# EAGLE design OpAmp_CCCV Regulator_2021_09_21_A (EAGLE 9.6.1)

## Sheet 1 of 2
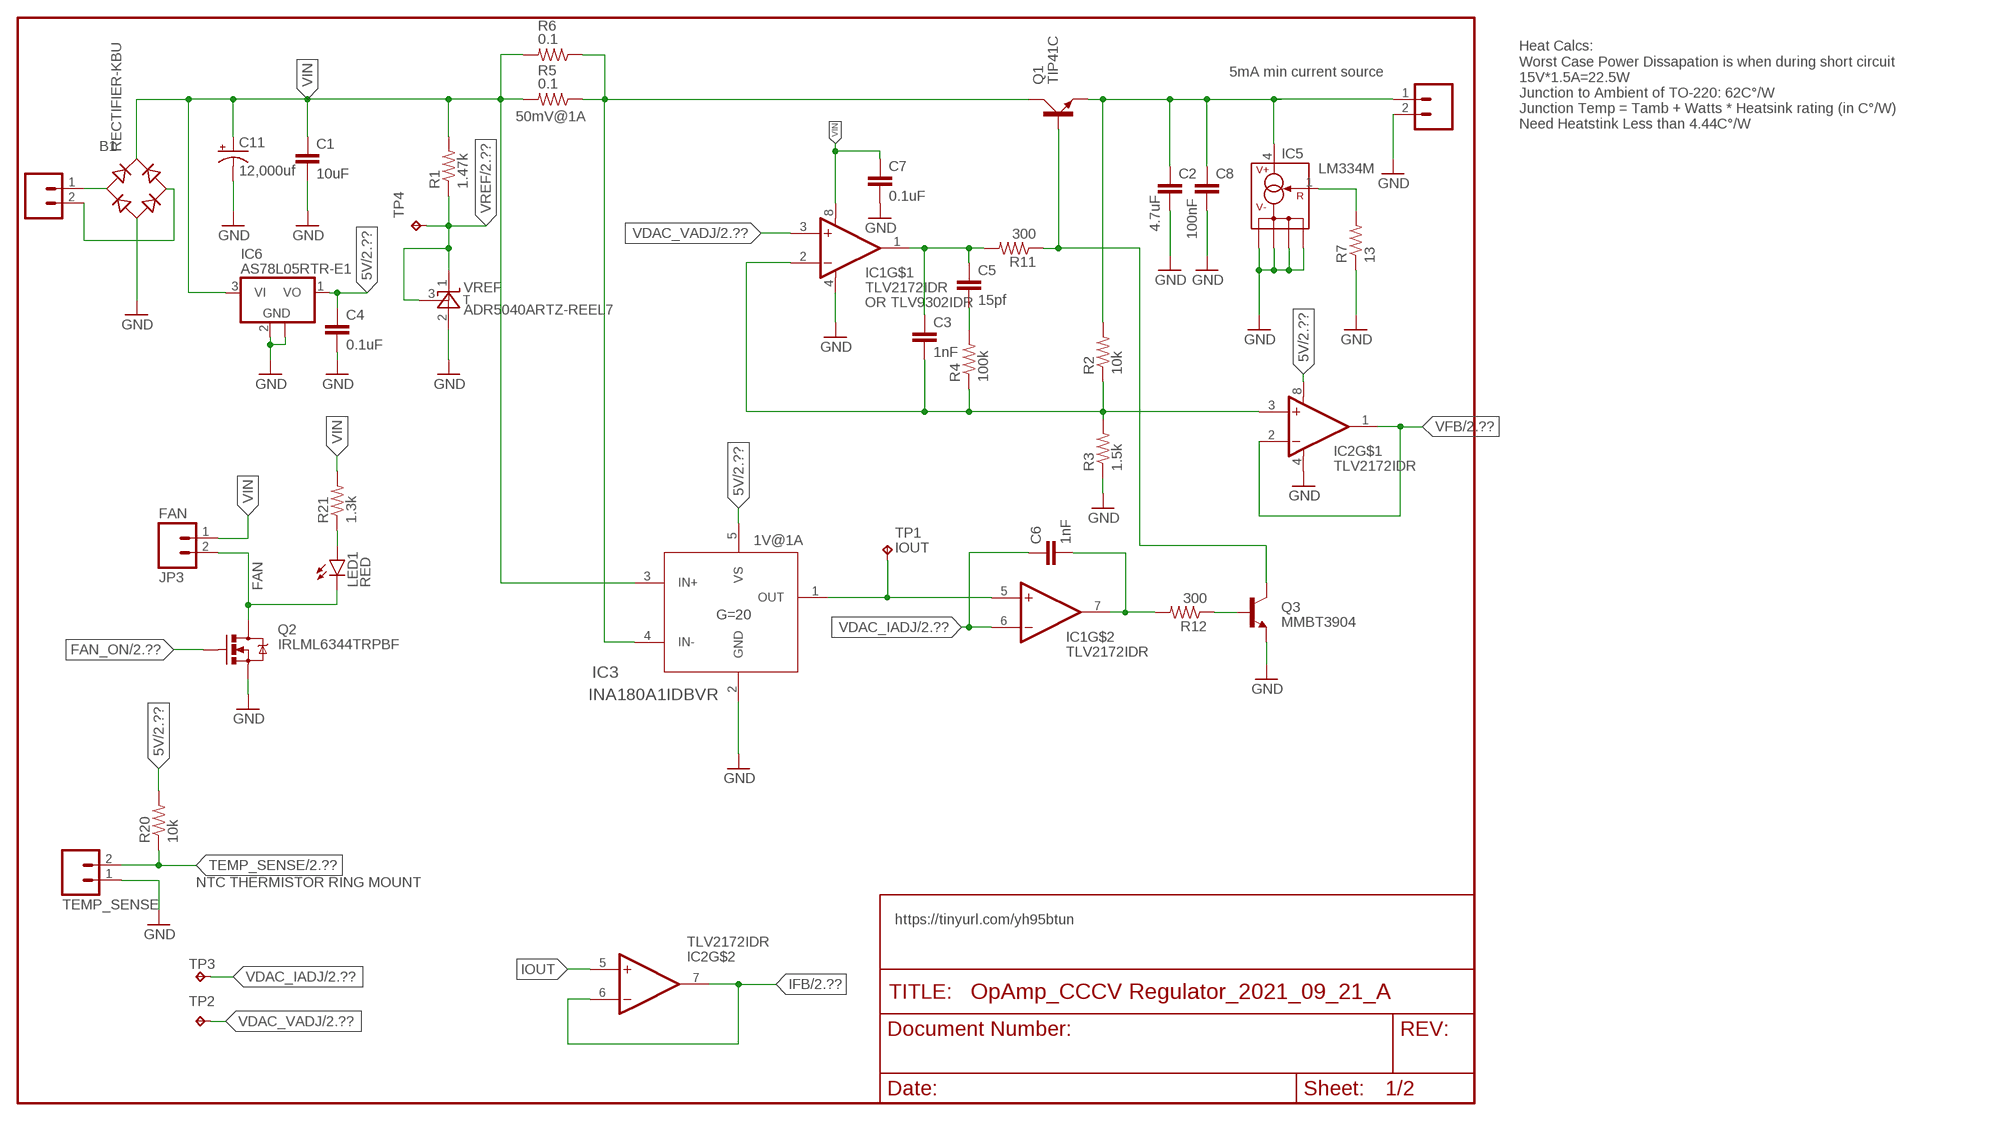
[diagram p0: schematic, sheet 1]

### Parts
B1  RECTIFIER-KBU  [KBU]
C1  10uF  CAP1206  [1206]
C2  4.7uF  CAP1206  [1206]
C3  1nF  CAP0805  [0805]
C4  0.1uF  CAP1206  [1206]
C5  15pf  CAP0805  [0805]
C6  1nF  CAP0805  [0805]
C7  0.1uF  CAP0805  [0805]
C8  100nF  CAP1206  [1206]
C11  12,000uf  CPOL-USE10-25  [EB25D]
IC1  TLV2172IDR  TLV2171IDR  [SOIC8]
IC2  TLV2172IDR  TLV2171IDR  [SOIC8]
IC3  INA180A1IDBVR  [DBV0005A_N]
IC5  LM334M  [SO08]
IC6  AS78L05RTR-E1  78L05F  [SOT89]
JP1  M023.5MM_LOCK  [SCREWTERMINAL-3.5MM-2_LOCK]
JP2  M023.5MM  [SCREWTERMINAL-3.5MM-2]
JP3  FAN  M02POLAR_LOCK  [MOLEX-1X2_LOCK]
JP4  TEMP_SENSE  M02PTH  [1X02]
LED1  RED  LED1206  [LED-1206]
Q1  TIP41C  [TO220AV]
Q2  IRLML6344TRPBF  MOSFET-NCHANNEL2N7002PW  [SOT323]
Q3  MMBT3904  TRANSISTOR_NPNSOT23  [SOT23]
R1  1.47k  RESISTOR1206  [1206]
R2  10k  RESISTOR1206  [1206]
R3  1.5k  RESISTOR1206  [1206]
R4  100k  RESISTOR0805-RES  [0805]
R5  0.1  RESISTOR1206  [1206]
R6  0.1  RESISTOR1206  [1206]
R7  13  RESISTOR1206  [1206]
R11  300  RESISTOR0805-RES  [0805]
R12  300  RESISTOR0805-RES  [0805]
R20  10k  RESISTOR1206  [1206]
R21  1.3k  RESISTOR1206  [1206]
TP1  TPTP20R  [TP20R]
TP2  TPTP20R  [TP20R]
TP3  TPTP20R  [TP20R]
TP4  TPTP20R  [TP20R]
VREF  ADR5040ARTZ-REEL7  [RT_3_ADI]

### Nets
5V: C4.1 IC2.8(V+) IC3.5(VS) IC6.1(VO) R20.2 ; also sheet 2
AC: B1.AC1 JP1.1
COMP: C3.1 C5.1 IC1.1(OUT) R11.2
FAN: JP3.2 LED1.C Q2.3(D)
FAN_ON: Q2.1(G) ; also sheet 2
FB: C3.2 IC1.2(-IN) IC2.3(+IN) R2.1 R3.2 R4.1
GND: B1.- C1.2 C2.2 C4.2 C7.2 C8.2 C11.- IC1.4(V-) IC2.4(V-) IC3.2(GND) IC5.2(V-) IC5.3(V-) IC5.6(V-) IC5.7(V-) IC6.2(GND) IC6.2@1(GND) JP2.2 JP4.1 Q2.2(S) Q3.2(E) R3.1 R7.1 VREF.2(A) ; also sheet 2
IFB: IC2.6(-IN) IC2.7(OUT) ; also sheet 2
IOUT: IC1.5(+IN) IC2.5(+IN) IC3.1(OUT) TP1.TP
IOUTA: C6.2 IC1.7(OUT) R12.2
N$3: C5.2 R4.2
N$5: B1.AC2 JP1.2
N$6: IC5.1(R) R7.2
N$7: Q3.1(B) R12.1
N$14: LED1.A R21.1
PASS_BASE: Q1.B Q3.3(C) R11.1
TEMP_SENSE: JP4.2 R20.1 ; also sheet 2
VDAC_IADJ: C6.1 IC1.6(-IN) TP3.TP ; also sheet 2
VDAC_VADJ: IC1.3(+IN) TP2.TP ; also sheet 2
VFB: IC2.1(OUT) IC2.2(-IN) ; also sheet 2
VIN: B1.+ C1.1 C7.1 C11.+ IC1.8(V+) IC3.3(IN+) IC6.3(VI) JP3.1 R1.2 R5.2 R6.2 R21.2
VIN2: IC3.4(IN-) Q1.C R5.1 R6.1
VOUT: C2.1 C8.1 IC5.4(V+) JP2.1 Q1.E R2.2
VREF: R1.1 TP4.TP VREF.1(C) VREF.3(T) ; also sheet 2

### Notes on the sheet
- 5mA min current source
- 50mV@1A
- Heat Calcs:
  Worst Case Power Dissapation is when during short circuit
  15V*1.5A=22.5W
  Junction to Ambient of TO-220: 62C°/W
  Junction Temp = Tamb + Watts * Heatsink rating (in C°/W)
  Need Heatstink Less than 4.44C°/W
- OR TLV9302IDR
- 1V@1A
- G=20
- NTC THERMISTOR RING MOUNT
- https://tinyurl.com/yh95btun

## Sheet 2 of 2
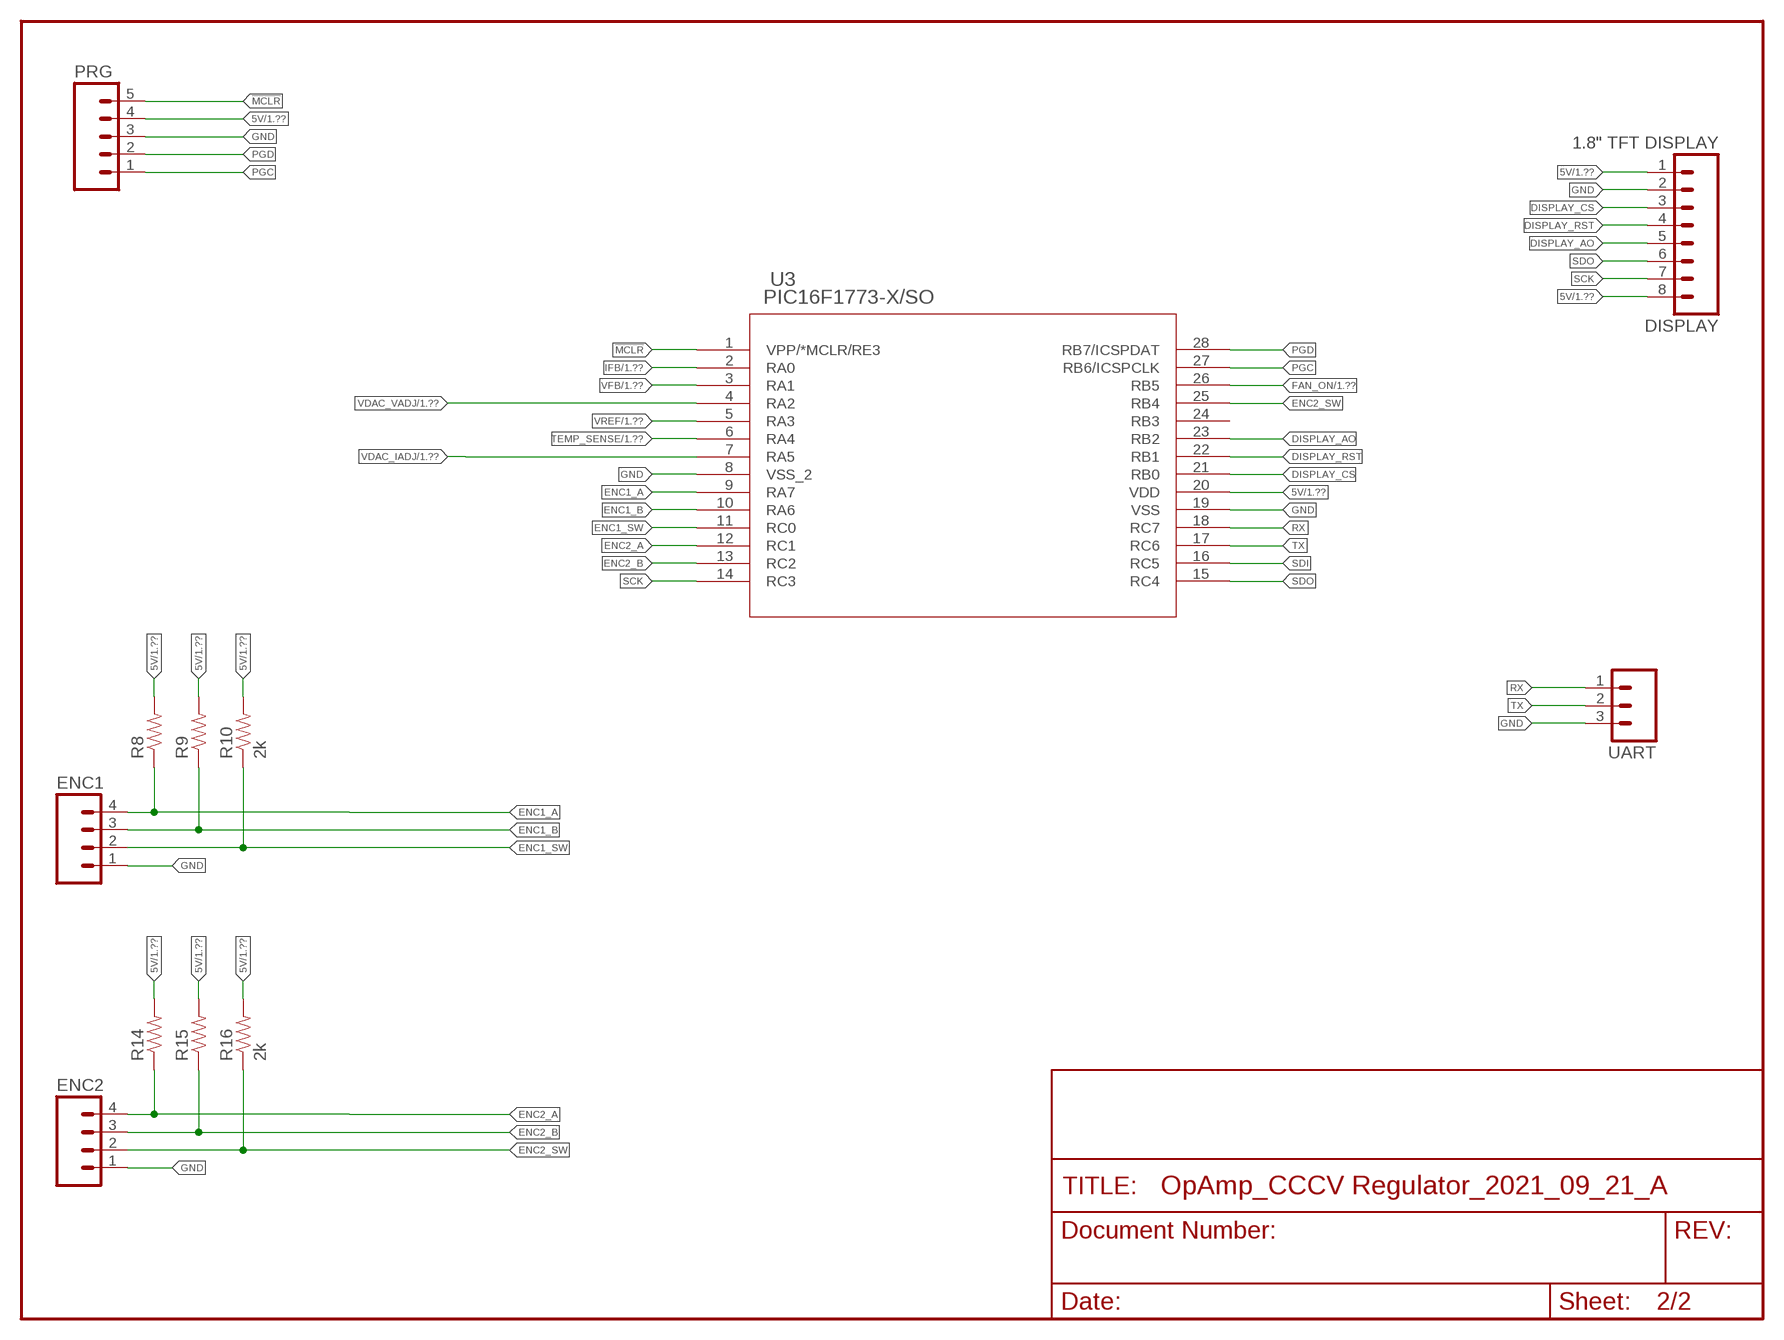
[diagram p1: schematic, sheet 2]

### Parts
DISPLAY  1.8" TFT DISPLAY  M08LOCK_LONGPADS  [1X08_LOCK_LONGPADS]
ENC1  M04LOCK_LONGPADS  [1X04_LOCK_LONGPADS]
ENC2  M04LOCK_LONGPADS  [1X04_LOCK_LONGPADS]
PRG  M05LOCK  [1X05_LOCK]
R8  2k  RESISTOR0805-RES  [0805]
R9  2k  RESISTOR0805-RES  [0805]
R10  2k  RESISTOR0805-RES  [0805]
R14  2k  RESISTOR0805-RES  [0805]
R15  2k  RESISTOR0805-RES  [0805]
R16  2k  RESISTOR0805-RES  [0805]
U3  PIC16F1773-X/SO  [SOIC28-W_MC]
UART  M03LOCK_LONGPADS  [1X03_LOCK_LONGPADS]

### Nets
5V: DISPLAY.1 DISPLAY.8 PRG.4 R8.2 R9.2 R10.2 R14.2 R15.2 R16.2 U3.20(VDD) ; also sheet 1
!MCLR: PRG.5 U3.1(VPP/*MCLR/RE3)
DISPLAY_AO: DISPLAY.5 U3.23(RB2)
DISPLAY_CS: DISPLAY.3 U3.21(RB0)
DISPLAY_RST: DISPLAY.4 U3.22(RB1)
ENC1_A: ENC1.4 R8.1 U3.9(RA7)
ENC1_B: ENC1.3 R9.1 U3.10(RA6)
ENC1_SW: ENC1.2 R10.1 U3.11(RC0)
ENC2_A: ENC2.4 R14.1 U3.12(RC1)
ENC2_B: ENC2.3 R15.1 U3.13(RC2)
ENC2_SW: ENC2.2 R16.1 U3.25(RB4)
FAN_ON: U3.26(RB5) ; also sheet 1
GND: DISPLAY.2 ENC1.1 ENC2.1 PRG.3 U3.8(VSS_2) U3.19(VSS) UART.3 ; also sheet 1
IFB: U3.2(RA0) ; also sheet 1
PGC: PRG.1 U3.27(RB6/ICSPCLK)
PGD: PRG.2 U3.28(RB7/ICSPDAT)
RX: U3.18(RC7) UART.1
SCK: DISPLAY.7 U3.14(RC3)
SDI: U3.16(RC5)
SDO: DISPLAY.6 U3.15(RC4)
TEMP_SENSE: U3.6(RA4) ; also sheet 1
TX: U3.17(RC6) UART.2
VDAC_IADJ: U3.7(RA5) ; also sheet 1
VDAC_VADJ: U3.4(RA2) ; also sheet 1
VFB: U3.3(RA1) ; also sheet 1
VREF: U3.5(RA3) ; also sheet 1
Unconnected: U3.24(RB3)

## Library data of the parts
B1 = rectifier:RECTIFIER-: Rectifier
C1 C2 C4 C8 = SparkFun-Capacitors:CAP: Capacitor Standard 0603 ceramic capacitor, and 0.1" leaded capacitor.
C3 C5-C7 = SparkFun:CAP: Capacitor Standard 0603 ceramic capacitor, and 0.1" leaded capacitor.
C11 = rcl:CPOL-US: POLARIZED CAPACITOR, American symbol; SPICEPREFIX: C
DISPLAY = SparkFun-Connectors:M08: Header 8 Standard 8-pin 0.1" header. Use with straight break away headers (SKU : PRT-00116), right angle break away headers (PRT-00553), swiss pins (PRT-00743), machine pins (PRT-00117), and female headers (PRT-00115).
ENC1 ENC2 = SparkFun-Connectors:M04: Header 4 Standard 4-pin 0.1" header. Use with straight break away headers (SKU : PRT-00116), right angle break away headers (PRT-00553), swiss pins (PRT-00743), machine pins (PRT-00117), and female headers (PRT-00115). Molex polarized connector foot print use with SKU : PRT-08231 with associated crimp pins and housings. 1MM SMD Version SKU: PRT-10208
IC1 IC2 = TLV2171IDR:TLV2171IDR
IC3 = INA180A1IDBVR:INA180A1IDBVR; MANUFACTURER: Texas Instruments; PARTNUMBER: INA180A1IDBVR; REFDES: RefDes; TYPE: TYPE; VALUE: Value
IC5 = linear:LM334*: 3-Terminal Adjustable Current Sources Source: www.national.com/pf/LM/LM334.html | LM134.pdf
IC6 = linear:78L*: POSITOIV-VOLTAGE REGULATORS Output up to 100 mA Source: Datasheet <http://focus.ti.com/lit/ds/symlink/ua78l05.pdf>
JP1-JP4 = SparkFun-Connectors:M02: Standard 2-pin 0.1" header. Use with - straight break away headers ( PRT-00116) - right angle break away headers (PRT-00553) - swiss pins (PRT-00743) - machine pins (PRT-00117) - female headers (PRT-00115) Molex polarized connector foot print use with: PRT-08233 with associated crimp pins and housings. 2.54_SCREWTERM for use with PRT-10571. 3.5mm Screw Terminal footprints for PRT-08084 5mm Screw Terminal footprints for use with PRT-08432
LED1 = SparkFun-LED:LED: LEDs Standard schematic elements and footprints for 5mm, 3mm, 1206, and 0603 sized LEDs. 5mm - Spark Fun Electronics SKU : COM-00529 (and others)
PRG = SparkFun-Connectors:M05: Header 5 Standard 5-pin 0.1" header. Use with straight break away headers (SKU : PRT-00116), right angle break away headers (PRT-00553), swiss pins (PRT-00743), machine pins (PRT-00117), and female headers (PRT-00115). Molex polarized connector foot print use with SKU : PRT-08230 with associated crimp pins and housings.
Q1 = transistor-power:TIP41C: NPN TRANSISTOR
Q2 = SparkFun-DiscreteSemi:MOSFET-NCHANNEL: Common NMOSFET Parts MFG P/N Store ID Prod ID FDD8780 TRANS-09984 SI7820DN TRANS-11055 FDS6630A IC-08089 2N7002PW TRANS-11151 FQP30N06L COM-10213 TRANS-10060 BSS123LT1G TRANS-08345 BSS138 TRANS-00830 BS170 2N7000; PROD_ID: TRANS-11151
Q3 = SparkFun-DiscreteSemi:TRANSISTOR_NPN: Generic NPN BJT MMBT2222A - TRANS-08049 (SOT-23, 1A 40V) MPSA42 - TRANS-09116 (SOT-23, 500mA 300V) MMBT5088LT1G - TRANS-11160 (SOT-23, 50 mA 30V) BC547 - COM-08928 <http://www.sparkfun.com/products/8928> (TO-92 45V 100mA) (1.Collector 2.Base 3.Emitter) 2N3904 - COM-00521 <http://www.sparkfun.com/products/521> (TO-92 40V 200mA) (1.Emitter 2.Base 3.Collector) P2N2222A - COM-12852 <http://www.sparkfun.com/products/12852> (TO-92 40V 600mA) (1.Collector 2.Base 3.Emitter)
R1-R3 R5-R10 R14-R16 R20 R21 = SparkFun-Resistors:RESISTOR: Resistor Basic schematic elements and footprints for 0603, 1206, and PTH resistors.
R4 R11 R12 = SparkFun:RESISTOR: Resistor Basic schematic elements and footprints for 0603, 1206, and PTH resistors.
TP1-TP4 = testpad:TP: Test pad
U3 = PIC16F Series:PIC16F1773-X/SO; COPYRIGHT: Copyright (C) 2016 Accelerated Designs. All rights reserved; MANUFACTURER_PART_NUMBER: pic16f1773-x/so; VENDOR: Microchip
UART = SparkFun-Connectors:M03: Header 3 Standard 3-pin 0.1" header. Use with straight break away headers (SKU : PRT-00116), right angle break away headers (PRT-00553), swiss pins (PRT-00743), machine pins (PRT-00117), and female headers (PRT-00115). Molex polarized connector foot print use with SKU : PRT-08232 with associated crimp pins and housings.
VREF = ADR5040ARTZ:ADR5040ARTZ-REEL7; BUILT_BY: EMA_UL_Team; MANUFACTURER_PART_NUMBER: ADR5040ARTZ-REEL7; SOURCELIBRARY: Analog_2015-01-06; VENDOR: Analog Devices Inc

## Board
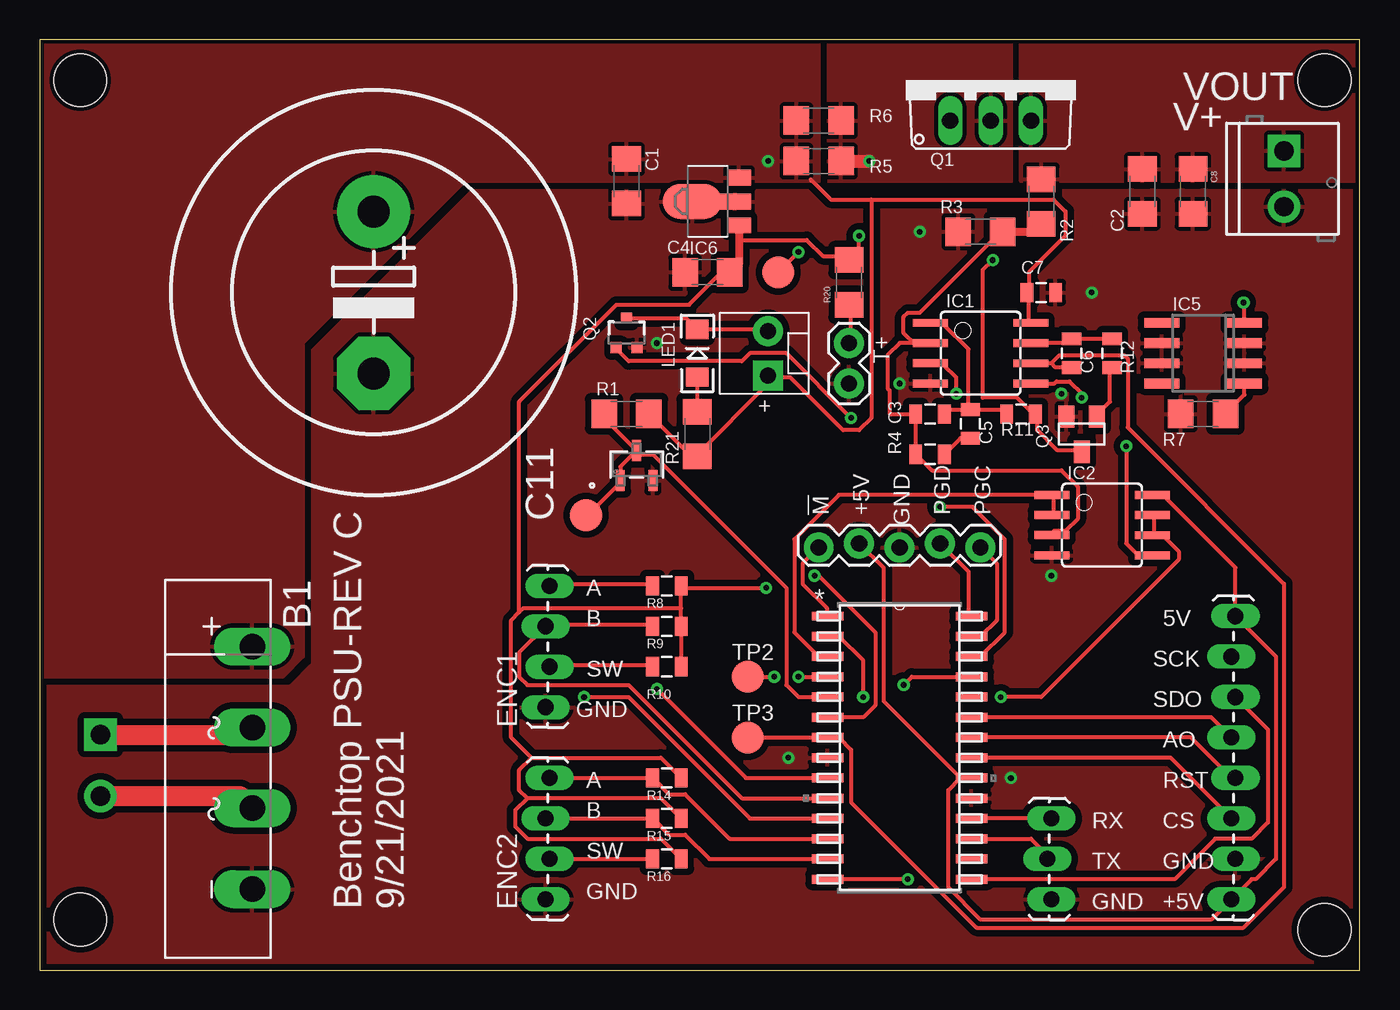
[diagram p2: board, top side]
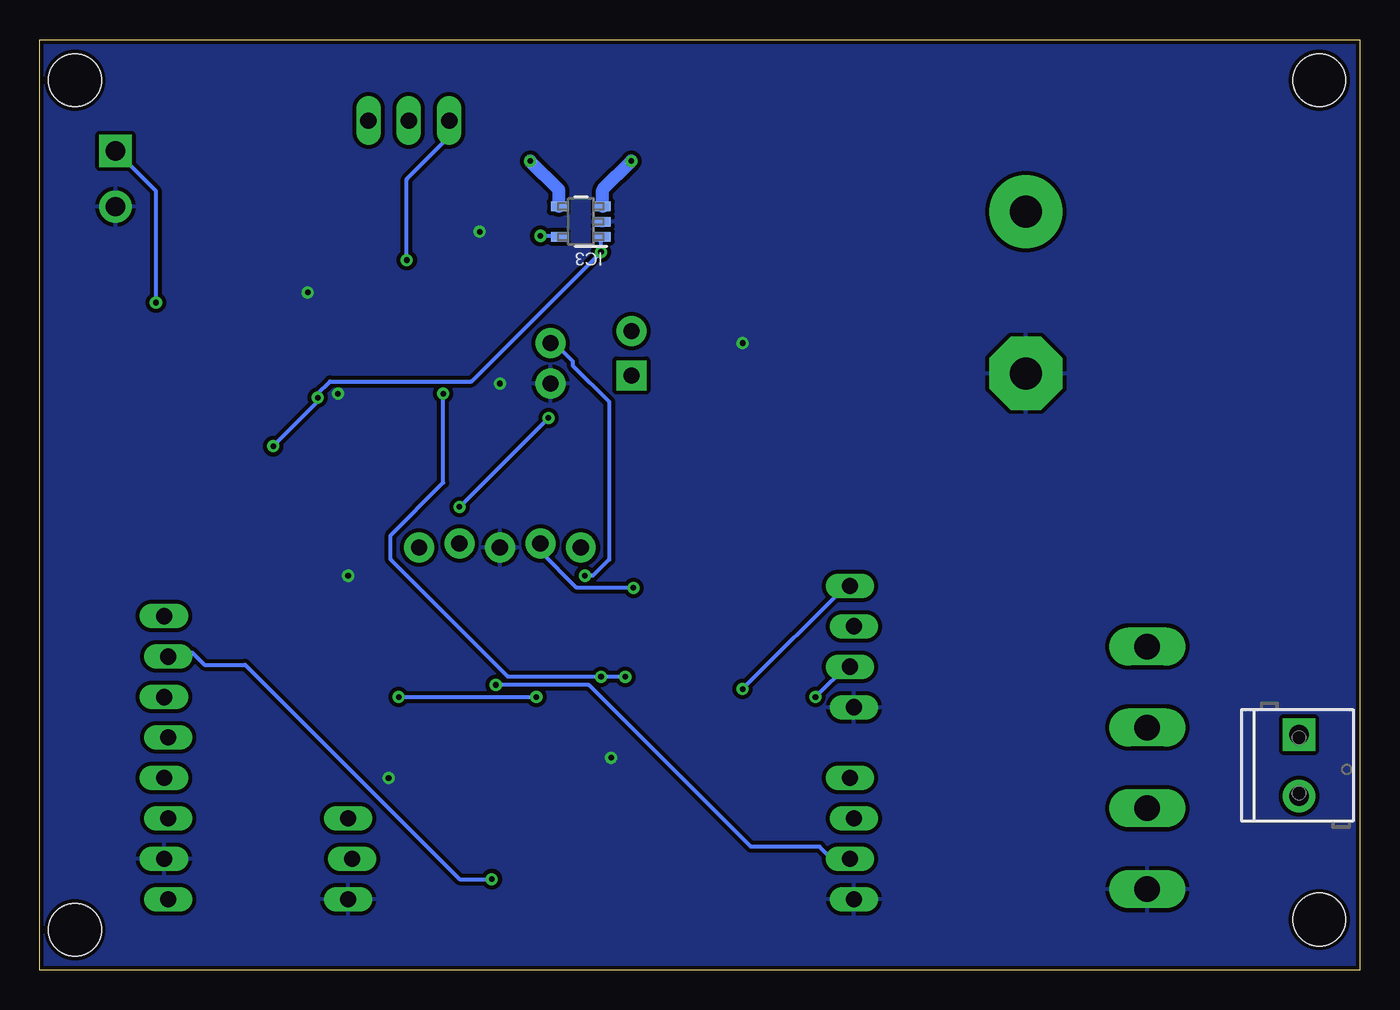
[diagram p3: board, bottom side, seen from below]

Size 82.85 x 58.41 mm. Coordinates in mm from the lower left corner, seen from the top.
Outline: 0,0 82.85,0 82.85,58.41 0,58.41 0,0
Copper layers (1*16): Top 0.035mm / dielectric 1.5mm / Bottom 0.035mm
Design rules "default": minimum track width 10mil, minimum drill 0.35mm, track to track 10mil, track to pad 10mil, pad to pad 10mil, via to via 10mil, smd to smd 6mil, copper to edge 10mil, drill to drill 6mil, minimum pad ring 10mil, minimum via ring 8mil, stop-mask expansion 4mil, vias tented up to drill 0mil, thermal gap 10mil
Holes 3.3 mm at 2.54,55.88 2.54,3.18 80.64,2.54 80.64,55.88

### Footprints (pad centres in the part's own frame; a part is rotated, then mirrored left to right if it is on the bottom)
KBU = drill 1.6 long: + -7.62,2.54; - 7.62,2.54; AC1 -2.54,2.54; AC2 2.54,2.54
1206 = smd 1.6 x 1.8: 1 -1.4,0; 2 1.4,0
0805 = smd 0.8 x 1.2: 1 -0.9,0; 2 0.9,0
EB25D = drill 2.007 pad 4.597: + -5.08,0 | drill 2.007 pad 4.597 octagon: - 5.08,0
1X08_LOCK_LONGPADS = drill 1.016 long: 1 0,0.127; 2 2.54,-0.127; 3 5.08,0.127; 4 7.62,-0.127; 5 10.16,0.127; 6 12.7,-0.127; 7 15.24,0.127; 8 17.78,-0.127
1X04_LOCK_LONGPADS = drill 1.016 long: 1 0,0; 2 2.54,-0.254; 3 5.08,0; 4 7.62,-0.254
SOIC8 = smd 0.5 x 2.2: 1 -1.905,-3.154; 2 -0.645,-3.154; 3 0.625,-3.154; 4 1.895,-3.154; 5 1.905,3.154; 6 0.635,3.154; 7 -0.635,3.154; 8 -1.905,3.154
DBV0005A_N = smd 1 x 0.6: 1 -1.375,0.95; 2 -1.375,0; 3 -1.375,-0.95; 4 1.375,-0.95; 5 1.375,0.95
SO08 = smd 0.6 x 2.2: 1 -1.905,-2.6; 2 -0.635,-2.6; 3 0.635,-2.6; 4 1.905,-2.6; 5 1.905,2.6; 6 0.635,2.6; 7 -0.635,2.6; 8 -1.905,2.6
SOT89 = smd 1 x 1.5: 1 -1.499,-1.981; 3 1.499,-1.981 | smd 1 x 2: 2 0,-1.727 | smd 2.2 x 3.7: 2@1 0,0.94
SCREWTERMINAL-3.5MM-2_LOCK = drill 1.2 pad 2.032 square: 1 -0.178,0 | drill 1.2 pad 2.032: 2 3.678,0
SCREWTERMINAL-3.5MM-2 = drill 1.2 pad 2.032 square: 1 0,0 | drill 1.2 pad 2.032: 2 3.5,0
MOLEX-1X2_LOCK = drill 1.016 pad 1.88 square: 1 -0.127,0 | drill 1.016 pad 1.88: 2 2.667,0
1X02 = drill 1.016 pad 1.88: 1 0,0; 2 2.54,0
LED-1206 = smd 1.2 x 1.4: A -1.5,0; C 1.5,0
1X05_LOCK = drill 1.016 pad 1.88: 1 0,0.127; 2 2.54,-0.127; 3 5.08,0.127; 4 7.62,-0.127; 5 10.16,0.127
TO220AV = drill 1.016 long: B -2.54,-2.54; C 0,-2.54; E 2.54,-2.54
SOT323 = smd 0.7 x 0.7: 1 -0.65,-0.925; 2 0.65,-0.925; 3 0,0.925
SOT23 = smd 1 x 1.4: 1 -0.95,-1.1; 2 0.95,-1.1; 3 0,1.1
TP20R = smd 2 x 2: TP 0,0
SOIC28-W_MC = smd 1.981 x 0.559: 1 -4.521,8.255; 2 -4.521,6.985; 3 -4.521,5.715; 4 -4.521,4.445; 5 -4.521,3.175; 6 -4.521,1.905; 7 -4.521,0.635; 8 -4.521,-0.635; 9 -4.521,-1.905; 10 -4.521,-3.175; 11 -4.521,-4.445; 12 -4.521,-5.715; 13 -4.521,-6.985; 14 -4.521,-8.255; 15 4.521,-8.255; 16 4.521,-6.985; 17 4.521,-5.715; 18 4.521,-4.445; 19 4.521,-3.175; 20 4.521,-1.905; 21 4.521,-0.635; 22 4.521,0.635; 23 4.521,1.905; 24 4.521,3.175; 25 4.521,4.445; 26 4.521,5.715; 27 4.521,6.985; 28 4.521,8.255
1X03_LOCK_LONGPADS = drill 1.016 long: 1 0,0; 2 2.54,-0.254; 3 5.08,0
RT_3_ADI = smd 0.559 x 1.321: 1 -1.025,-1.016; 2 1.025,-1.016; 3 0,0.883

### Placement (x,y rotation side)
B1  10.79,12.7 270 top
C1  36.83,49.53 270 top
C2  69.21,48.9 270 top
C3  55.88,34.92 180 top
C4  41.91,43.81 180 top
C5  58.42,34.29 270 top
C6  64.77,38.73 90 top
C7  62.87,42.55 0 top
C8  72.39,48.9 270 top
C11  20.95,42.55 270 top
DISPLAY  74.93,4.45 90 top
ENC1  31.75,16.51 90 top
ENC2  31.75,4.45 90 top
IC1  59.05,38.73 270 top
IC2  66.67,27.94 270 top
IC3  48.9,46.99 180 bottom
IC5  73.02,38.73 90 top
IC6  41.91,48.26 90 top
JP1  3.81,14.61 270 bottom
JP2  78.1,51.44 270 top
JP3  45.72,37.47 90 top
JP4  50.8,36.83 90 top
LED1  41.27,38.73 90 top
PRG  59.05,26.67 180 top
Q1  59.69,55.88 0 top
Q2  36.83,40.01 0 top
Q3  65.41,33.66 180 top
R1  36.83,34.92 0 top
R2  62.87,48.26 90 top
R3  59.05,46.36 0 top
R4  55.88,32.39 0 top
R5  48.9,50.8 180 top
R6  48.9,53.34 180 top
R7  73.02,34.92 0 top
R8  39.37,24.13 0 top
R9  39.37,21.59 0 top
R10  39.37,19.05 0 top
R11  61.6,34.92 180 top
R12  67.31,38.73 90 top
R14  39.37,12.07 0 top
R15  39.37,9.53 0 top
R16  39.37,6.99 0 top
R20  50.8,43.18 90 top
R21  41.27,33.66 270 top
TP1  46.36,43.81 0 top
TP2  44.45,18.42 0 top
TP3  44.45,14.61 0 top
TP4  34.29,28.57 0 top
U3  53.98,13.97 0 top
UART  63.5,9.53 270 top
VREF  37.47,31.75 0 top

### Tracks (layer width: path | path; a pad name or v marks a point on that pad's centre or on a via)
5V  (via drill 0.35)
  Top 0.254: 57.79,12.07 U3.20 58.29,12.07 | 57.79,12.07 52.96,16.89 52.96,25.27 PRG.4 | IC2.8 70.48,29.85 75.06,25.27 DISPLAY.8 77.6,19.68 77.6,6.99 76.33,5.71 76.07,5.71 DISPLAY.1 73.53,3.18 59.05,3.18 57.02,5.21 57.02,11.3 57.79,12.07 | v51.44,46.1 51.44,45.34 50.93,44.83 R20.2 50.67,44.83 49.15,44.83 48.13,45.85 43.89,45.85 | R10.2 40.26,19.18 40.26,21.46 R9.2 40.26,21.72 40.26,22.73 | 40.26,22.73 40.26,24 R8.2 40.51,24 v45.59,24 | 30.61,10.79 29.84,10.03 29.84,9.02 30.61,8.25 38.99,8.25 40.26,6.99 R16.2 | 30.61,10.79 38.99,10.79 40.26,9.53 R15.2 | 30.86,13.33 38.99,13.33 40.26,12.07 R14.2 | 30.86,13.33 30.1,12.57 30.1,11.3 30.61,10.79 | 40.26,22.73 30.35,22.73 30.1,22.48 | 30.1,22.48 29.59,21.97 29.59,14.61 30.86,13.33 | C4.1 42.8,43.81 40.77,41.78 36.2,41.78 30.1,35.69 30.1,22.48
  Top 0.508: IC6.1 43.89,45.85 43.89,44.4 C4.1
  Bottom 0.254: v51.44,46.1 50.42,46.1 IC3.5 | PRG.4 51.44,26.29 49.15,24 v45.59,24
!MCLR
  Top 0.254: PRG.5 47.88,25.53 47.88,24.26 49.4,22.73 49.4,22.22 U3.1
AC
  Top 1.27: JP1.1 12.88,14.78 B1.AC1
COMP
  Top 0.254: C3.1 57.04,35.19 C5.1 | C5.1 60.43,35.19 R11.2 | IC1.1 56.01,40.51 56.77,40.51 58.29,38.99 58.29,35.43 C5.1
DISPLAY_AO
  Top 0.254: U3.23 73.53,15.87 DISPLAY.5
DISPLAY_CS
  Top 0.254: U3.21 70.99,13.33 DISPLAY.3
DISPLAY_RST
  Top 0.254: U3.22 72.26,14.61 74.8,12.07 DISPLAY.4
ENC1_A  (via drill 0.35)
  Top 0.254: R8.1 38.23,24.26 32.13,24.26 ENC1.4 | U3.9 44.32,12.07 v38.73,17.65
  Bottom 0.254: v38.73,17.65 32.13,24.26 ENC1.4
ENC1_B
  Top 0.254: R9.1 38.23,21.72 31.88,21.72 ENC1.3 30.1,19.94 30.1,18.42 30.61,17.91 36.96,17.91 44.07,10.79 U3.10
ENC1_SW  (via drill 0.35)
  Top 0.254: R10.1 38.23,19.18 32.13,19.18 ENC1.2 | U3.11 44.58,9.53 36.96,17.14 v34.16,17.14
  Bottom 0.254: v34.16,17.14 32.13,19.18 ENC1.2
ENC2_A
  Top 0.254: ENC2.4 R14.1 39.5,11.05 40.51,11.05 43.31,8.25 U3.12
ENC2_B
  Top 0.254: ENC2.3 R15.1 39.5,8.51 40.51,8.51 42.04,6.99 U3.13
ENC2_SW  (via drill 0.35)
  Top 0.254: ENC2.2 R16.1 | U3.25 54.74,18.42 v54.23,17.91
  Bottom 0.254: v54.23,17.91 48.39,17.91 38.23,7.75 33.91,7.75 33.15,6.99 ENC2.2
FAN
  Top 0.254: Q2.3 40.58,40.93 LED1.C 46.12,40.23 46.23,40.13 | 46.36,40.01 46.23,40.13 | 46.23,40.13 JP3.2
FAN_ON  (via drill 0.35)
  Top 0.254: v50.93,34.67 46.86,38.73 44.58,38.73 44.07,38.23 36.96,38.23 36.2,38.99 Q2.1 | v56.52,29.08 58.55,29.08 60.58,27.05 60.58,21.21 59.05,19.68 U3.26
  Bottom 0.254: v56.52,29.08 v50.93,34.67
FB
  Top 0.254: C3.2 R4.1 54.99,32.39 56.01,31.37 64.13,31.37 65.15,30.35 65.15,28.32 64.39,27.56 63.63,27.56 IC2.3 | 54.74,35.31 54.74,34.92 C3.2 | 54.99,39.24 55.75,39.24 IC1.2 | 54.99,39.24 54.23,40.01 54.23,41.02 54.48,41.28 55.24,41.28 60.32,46.36 R3.2 | 54.99,39.24 IC1.2 | IC1.2 53.98,39.38 53.22,38.61 53.22,36.52 53.34,36.39 53.34,34.92 C3.2
  Top 0.508: R3.2 62.36,46.36 R2.1
GND  (via drill 0.35)
  other vias: 64.13,36.19 46.99,13.33 60.96,12.07 55.24,46.36 66.04,42.55 38.73,39.37 53.98,36.83 63.5,24.76
  pour Top (isolate 0.406, rank 2): -5.71,60.96 93.98,60.96 93.98,-1.91 92.71,-3.18 -5.71,-3.18
  pour Bottom: -8.89,61.59 97.16,61.59 97.16,-5.08 -8.89,-5.08
IFB  (via drill 0.35)
  Top 0.254: U3.2 50.16,20.96 51.69,19.43 v51.69,17.14 | v60.32,17.14 62.87,17.14 71.5,25.78 71.5,26.29 70.48,27.31 69.98,27.31 | 69.98,27.31 69.98,28.57 IC2.7 | 69.98,27.31 IC2.6
  Bottom 0.254: v60.32,17.14 v51.69,17.14
IOUT  (via drill 0.35)
  Top 0.254: TP1.TP v47.62,45.09 | IC2.5 68.96,26.04 68.2,26.8 v68.2,32.89 | v65.41,35.94 65.41,36.19 64.65,36.95 63.82,36.95 63.7,36.83 IC1.5
  Bottom 0.254: IC3.1 47.62,45.85 v47.62,45.09 55.75,36.96 64.64,36.96 65.41,36.19 v65.41,35.94 65.41,35.69 v68.2,32.89
IOUTA
  Top 0.254: IC1.7 64.5,39.37 C6.2 R12.2
N$3
  Top 0.254: R4.2 57.79,33.39 C5.2
N$5
  Top 1.27: JP1.2 12.57,10.93 B1.AC2
N$6
  Top 0.254: R7.2 75.62,36.12 IC5.1
N$7
  Top 0.254: R12.1 67.18,37.72 67.18,35.69 66.42,34.92 Q3.1
N$14
  Top 0.254: R21.1 LED1.A
PASS_BASE  (via drill 0.35)
  Top 0.254: Q3.3 65.41,32.64 63.88,32.64 62.61,33.91 62.61,34.92 R11.1 62.36,34.92 61.34,35.94 59.18,35.94 59.18,43.94 v59.82,44.58
  Bottom 0.254: v59.82,44.58 59.82,49.66 57.28,52.2 57.28,53.21 Q1.B
PGC
  Top 0.254: U3.27 59.05,20.96 60.07,21.97 60.07,25.53 PRG.1
PGD
  Top 0.254: PRG.2 58.29,25.02 58.29,22.22 U3.28
RX
  Top 0.254: UART.1 U3.18
SCK  (via drill 0.35)
  Top 0.254: v54.48,5.71 U3.14
  Bottom 0.254: v54.48,5.71 56.52,5.71 69.98,19.18 72.52,19.18 73.28,19.94 74.55,19.94 DISPLAY.7
SDO
  Top 0.254: U3.15 71.25,5.71 73.79,8.25 76.07,8.25 77.09,9.27 77.09,15.11 DISPLAY.6
TEMP_SENSE  (via drill 0.35)
  Top 0.254: R20.1 50.93,41.53 50.93,39.5 JP4.2 | U3.6 51.69,15.87 52.45,16.64 52.45,21.21 48.9,24.76 v48.64,24.76
  Bottom 0.254: v48.64,24.76 48.13,24.76 47.12,25.78 47.12,35.69 49.4,37.97 49.4,38.23 50.67,39.5 JP4.2
TX
  Top 0.254: U3.17 62.23,8.25 63.25,7.24 UART.2
VDAC_IADJ
  Top 0.254: TP3.TP U3.7 50.16,14.61 50.93,13.84 50.93,10.54 58.8,2.67 75.56,2.67 78.1,5.21 78.1,24.26 68.29,34.07 68.29,38.39 68.07,38.62 64.01,38.62 63.5,38.1 | IC1.6 63.5,38.1 | C6.1 63.76,37.83 63.5,38.1
VDAC_VADJ  (via drill 0.35)
  Top 0.254: v47.62,18.42 U3.4 | TP2.TP v46.1,18.42 | v57.53,36.19 57.53,37.21 56.77,37.97 56.01,37.97 IC1.3
  Bottom 0.254: v46.1,18.42 v47.62,18.42 53.47,18.42 60.83,25.78 60.83,27.31 57.53,30.61 v57.53,36.19
VFB
  Top 0.254: U3.3 48.9,19.68 47.37,21.21 47.37,27.05 50.16,29.85 IC2.1 63.63,29.85 63.63,28.83 IC2.2
VIN  (via drill 0.35)
  Top 0.254: R1.2 40.9,32.25 R21.2 41.27,32.39 45.59,36.7 45.59,37.21 JP3.1 45.85,37.21 47.12,37.21 50.42,33.91 51.44,33.91 52.2,34.67 52.2,48.39 | 62.1,42.55 62.1,40.77 IC1.8 | 62.1,42.55 62.1,43.81 64.39,46.1 64.39,47.62 63.63,48.39 52.2,48.39 | 52.2,48.39 49.66,48.39 48.39,49.66 48.42,49.54 | 62.1,42.55 C7.1
  Bottom 0.813: IC3.3 47.52,49 v45.72,50.8
  pour Top (isolate 0.254): 0.63,60.33 48.9,60.33 48.9,49.53 43.18,49.53 26.67,49.53 16.51,39.37 16.51,19.68 15.24,18.42 -0.63,18.42 -0.63,59.06
VIN2  (via drill 0.35)
  Top 0.813: R5.1 v52.07,50.8
  Bottom 0.813: IC3.4 50.27,49 v52.07,50.8
  pour Top (isolate 0.254): 49.53,58.42 60.96,58.42 60.96,49.53 49.53,49.53
VOUT  (via drill 0.35)
  Top 0.254: IC5.4 75.62,41.85 v75.56,41.91
  Bottom 0.254: v75.56,41.91 75.56,48.9 JP2.1
  pour Top: 61.6,58.42 91.44,58.42 91.44,49.53 61.6,49.53
VREF
  Top 0.254: VREF.3 36.44,31.61 VREF.1 36.45,30.61 34.42,28.57 TP4.TP | VREF.3 35.43,34.67 R1.1 | U3.5 47.62,17.14 46.86,17.91 46.86,24 38.48,32.39 37.47,32.39 VREF.3

### Text on the board
tPlace: VOUT | V+ | RX | TX | Benchtop PSU-REV C / 9/21/2021
tNames: T+ | + | !M | +5V | PGD | PGC | GND | A | B | 5V | SCK | SW | SDO | GND | AO | A | RST | B | CS | SW | GND | GND | GND | +5V
Measures: AC IN / 36V MAX